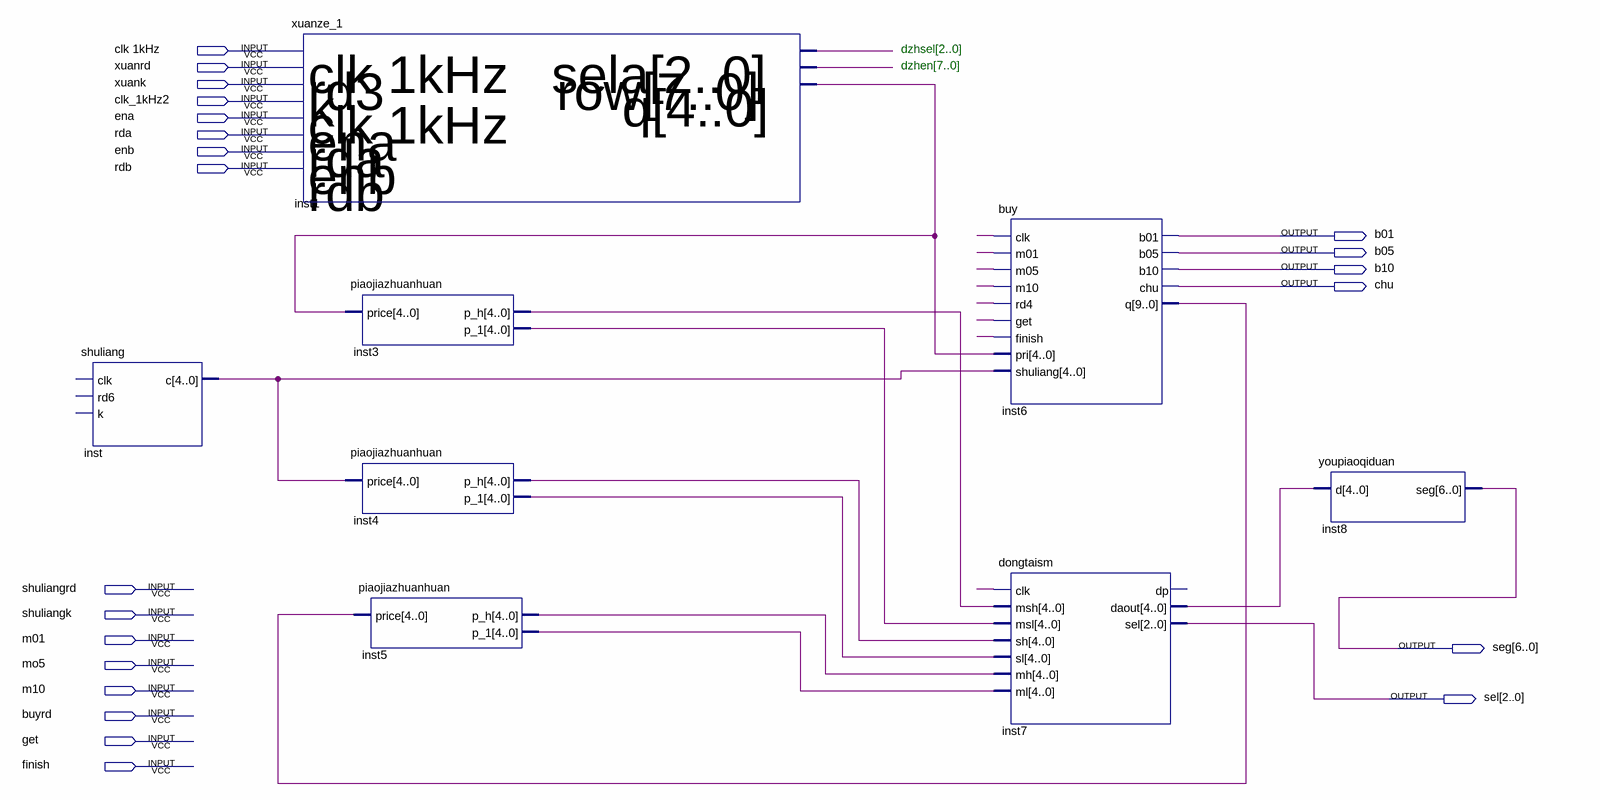
[diagram p0: schematic sheet]
// Quartus schematic zonghe_sheji.bdf as structural Verilog: 8 symbols, 22 pins
module zonghe_sheji (
  input  \clk_1kHz ,
  input  xuanrd,
  input  xuank,
  input  clk_1kHz2,
  input  ena,
  input  rda,
  input  enb,
  input  rdb,
  input  shuliangrd,
  input  shuliangk,
  input  m01,
  input  mo5,
  input  m10,
  input  buyrd,
  input  get,
  input  finish,
  output b01,
  output b05,
  output b10,
  output chu,
  output [6:0] seg,
  output [2:0] sel
);

  wire inst1_row, inst1_sela, inst6_q, undriven, undriven_2, undriven_3, undriven_4, undriven_5, undriven_6,
       undriven_7, undriven_8;
  wire [4:0] inst1_q, inst3_p_1, inst3_p_h, inst4_p_1, inst4_p_h, inst5_p_1, inst5_p_h, inst7_daout, inst_c;

  shuliang inst (.c(inst_c));  // open: clk, rd6, k
  xuanze_1 inst1 (
    .\clk_1kHz ({\clk_1kHz , clk_1kHz2}), .rd3(xuanrd), .k(xuank), .ena(ena), .rda(rda), .enb(enb),
    .rdb(rdb), .sela(inst1_sela), .row(inst1_row), .q(inst1_q));
  piaojiazhuanhuan inst3 (.price(inst1_q), .p_h(inst3_p_h), .p_1(inst3_p_1));
  piaojiazhuanhuan inst4 (.price(inst_c), .p_h(inst4_p_h), .p_1(inst4_p_1));
  piaojiazhuanhuan inst5 (.price({5{inst6_q}}), .p_h(inst5_p_h), .p_1(inst5_p_1));
  buy inst6 (
    .clk(undriven_2), .m01(undriven_3), .m05(undriven_4), .m10(undriven_5), .rd4(undriven_6),
    .get(undriven_7), .finish(undriven_8), .pri(inst1_q), .shuliang(inst_c), .b01(b01), .b05(b05), .b10(b10),
    .chu(chu), .q(inst6_q));
  dongtaism inst7 (
    .clk(undriven), .msh(inst3_p_h), .msl(inst3_p_1), .sh(inst4_p_h), .sl(inst4_p_1), .mh(inst5_p_h),
    .ml(inst5_p_1), .daout(inst7_daout), .sel(sel));  // open: dp
  youpiaoqiduan inst8 (.d(inst7_daout), .seg(seg));

  // Notes on the sheet:
  //   dzhsel[2..0]
  //   dzhen[7..0]
endmodule
